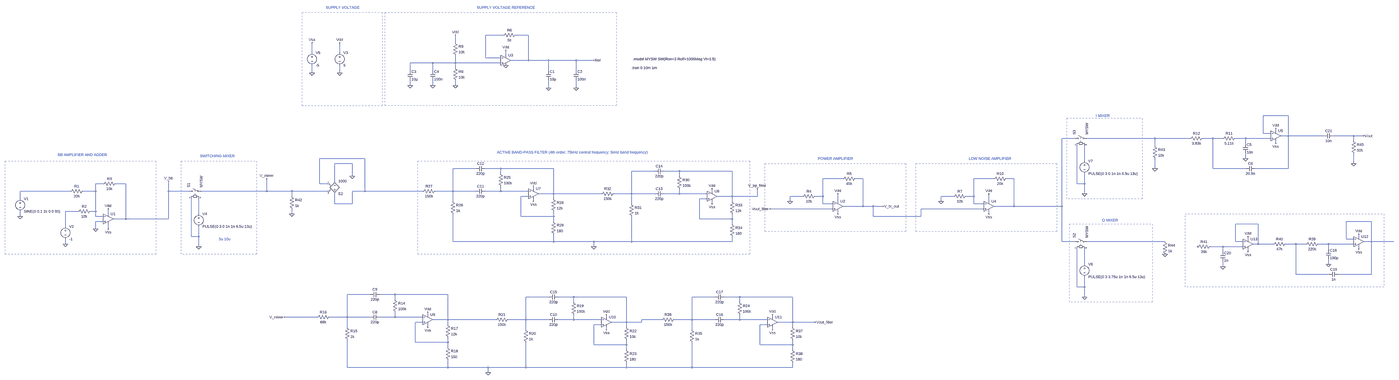
[diagram p0: schematic transceiver_aposAula.asc, whole sheet]
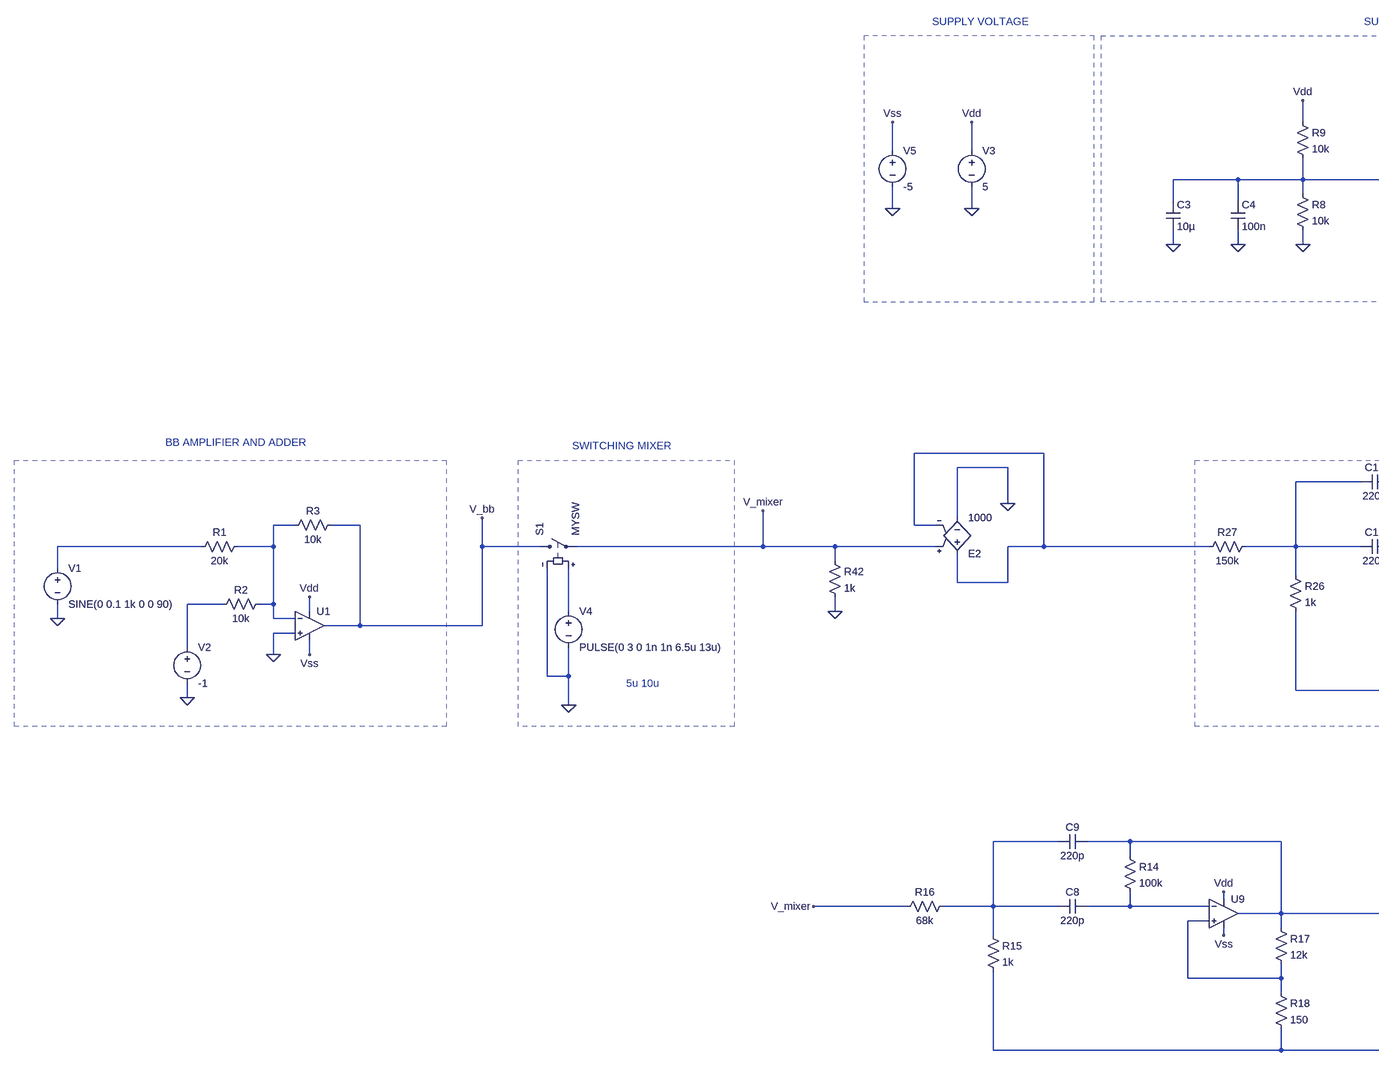
[diagram p1: schematic transceiver_aposAula.asc, part, row 1 of 1, column 1 of 3]
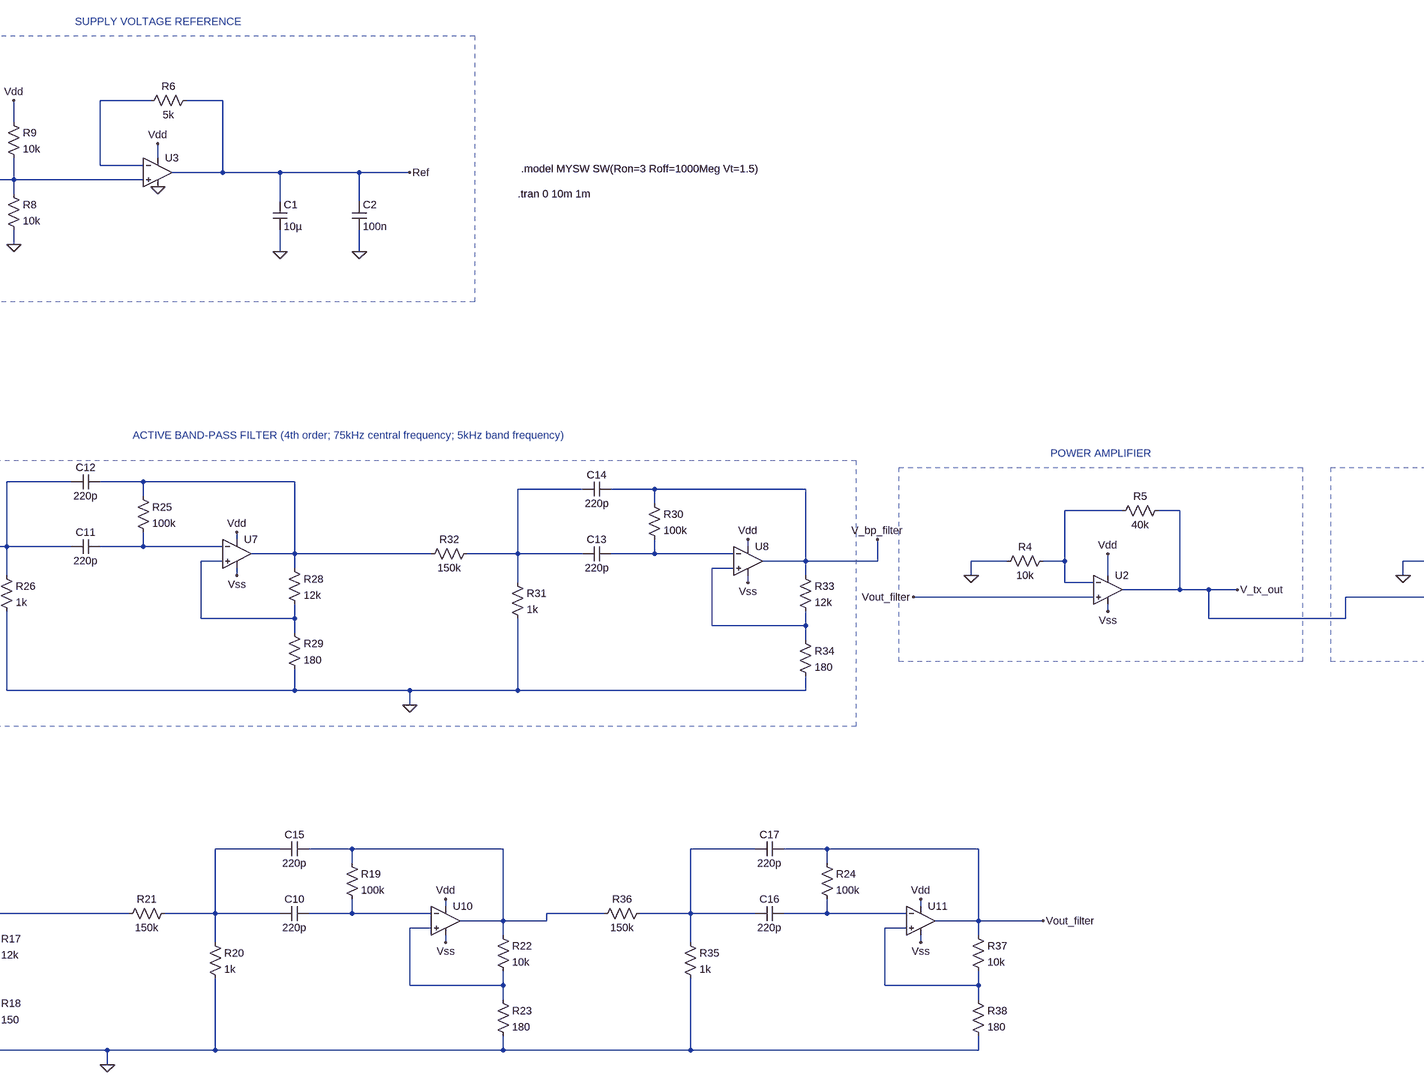
[diagram p2: schematic transceiver_aposAula.asc, part, row 1 of 1, column 2 of 3]
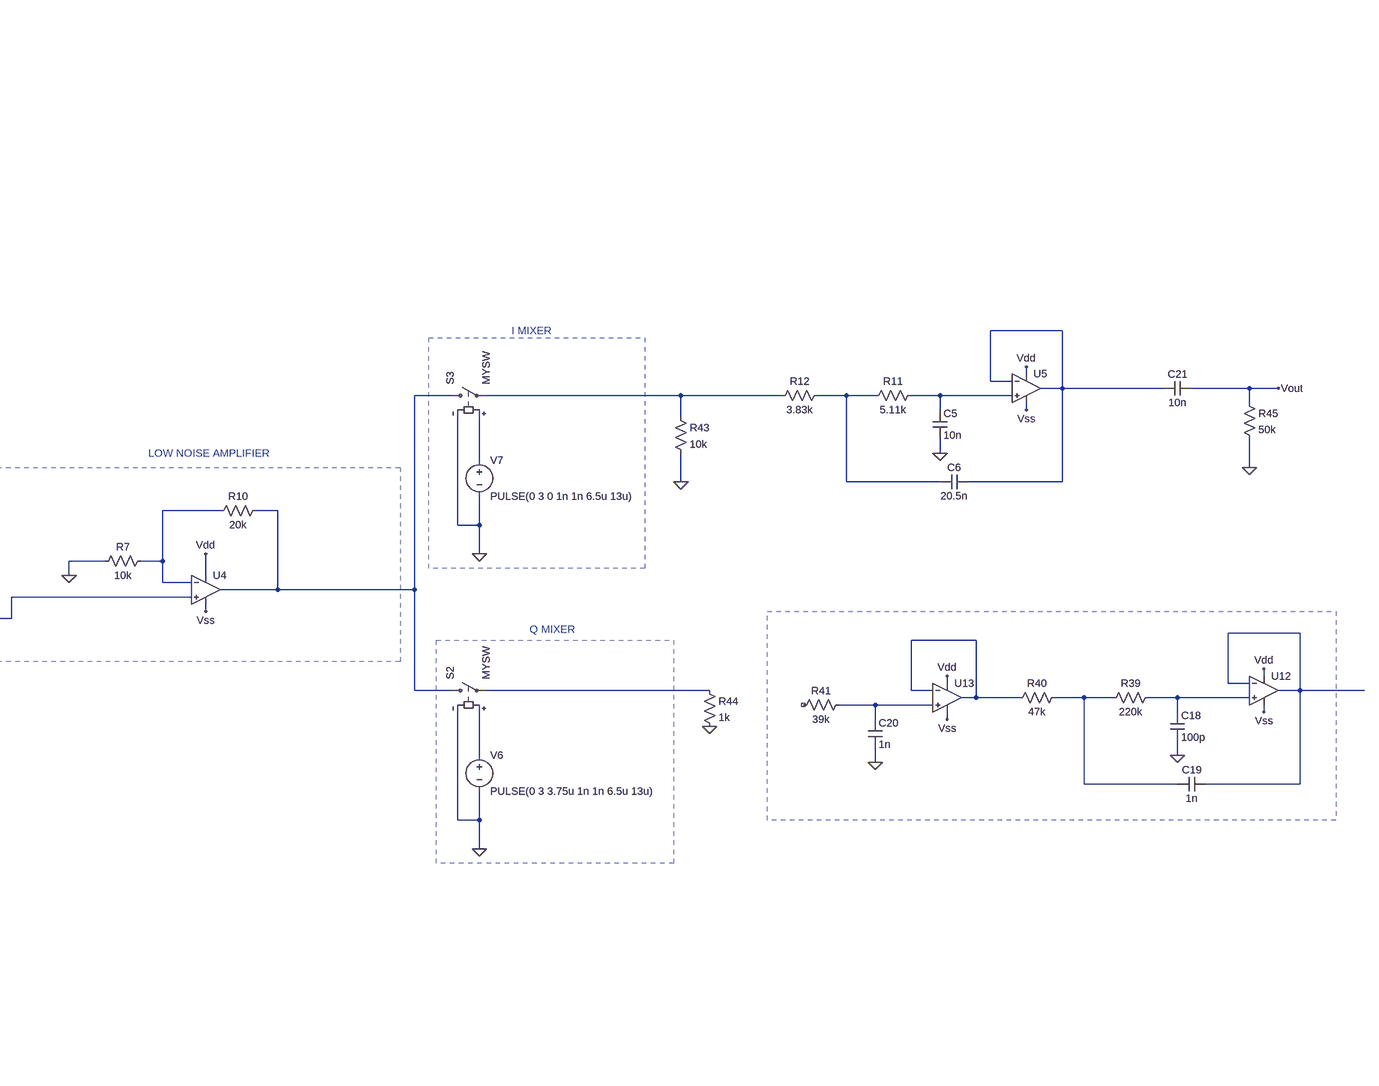
[diagram p3: schematic transceiver_aposAula.asc, part, row 1 of 1, column 3 of 3]
transceiver_aposAula.asc, the LTspice schematic file:
Version 4
SHEET 1 6180 1220
WIRE -192 -1264 -304 -1264
WIRE -32 -1264 -112 -1264
WIRE -496 -1216 -496 -1264
WIRE -1408 -1152 -1408 -1216
WIRE -1232 -1152 -1232 -1216
WIRE -176 -1136 -176 -1168
WIRE -304 -1120 -304 -1264
WIRE -208 -1120 -304 -1120
WIRE -32 -1104 -32 -1264
WIRE -32 -1104 -144 -1104
WIRE 96 -1104 -32 -1104
WIRE 272 -1104 96 -1104
WIRE 384 -1104 272 -1104
WIRE -640 -1088 -784 -1088
WIRE -496 -1088 -496 -1136
WIRE -496 -1088 -640 -1088
WIRE -208 -1088 -496 -1088
WIRE -496 -1056 -496 -1088
WIRE -784 -1040 -784 -1088
WIRE -640 -1040 -640 -1088
WIRE 96 -1040 96 -1104
WIRE 272 -1040 272 -1104
WIRE -1408 -1024 -1408 -1072
WIRE -1232 -1024 -1232 -1072
WIRE -784 -944 -784 -976
WIRE -640 -944 -640 -976
WIRE -496 -944 -496 -976
WIRE 96 -928 96 -976
WIRE 272 -928 272 -976
WIRE 4800 -752 4640 -752
WIRE 4720 -656 4720 -672
WIRE 4640 -640 4640 -752
WIRE 4688 -640 4640 -640
WIRE 4800 -624 4800 -752
WIRE 4800 -624 4752 -624
WIRE 5024 -624 4800 -624
WIRE 5216 -624 5088 -624
WIRE 5280 -624 5216 -624
WIRE 3440 -608 3360 -608
WIRE 3952 -608 3520 -608
WIRE 4176 -608 3952 -608
WIRE 4320 -608 4256 -608
WIRE 4384 -608 4320 -608
WIRE 4528 -608 4464 -608
WIRE 4688 -608 4528 -608
WIRE 5216 -592 5216 -624
WIRE 4528 -576 4528 -608
WIRE 4720 -576 4720 -592
WIRE 3952 -560 3952 -608
WIRE -1072 -480 -1360 -480
WIRE 4528 -480 4528 -512
WIRE 3504 -464 3504 -560
WIRE -1152 -448 -1264 -448
WIRE 5216 -448 5216 -512
WIRE -368 -416 -512 -416
WIRE -208 -416 -304 -416
WIRE 128 -416 -208 -416
WIRE 3952 -416 3952 -480
WIRE 4320 -416 4320 -608
WIRE 4528 -416 4320 -416
WIRE 4800 -416 4800 -624
WIRE 4800 -416 4592 -416
WIRE 768 -400 624 -400
WIRE 928 -400 832 -400
WIRE 1264 -400 928 -400
WIRE -208 -384 -208 -416
WIRE -1152 -368 -1152 -448
WIRE 928 -368 928 -400
WIRE 1968 -352 1840 -352
WIRE 2096 -352 2048 -352
WIRE 2928 -352 2800 -352
WIRE 3056 -352 3008 -352
WIRE -1264 -336 -1264 -448
WIRE -2736 -320 -2784 -320
WIRE -2592 -320 -2656 -320
WIRE -1360 -320 -1360 -480
WIRE -1312 -320 -1360 -320
WIRE 3456 -320 3456 -560
WIRE 3504 -320 3504 -384
WIRE 3504 -320 3456 -320
WIRE 0 -288 0 -304
WIRE -2944 -272 -3264 -272
WIRE -2784 -272 -2784 -320
WIRE -2784 -272 -2864 -272
WIRE -2320 -272 -2320 -336
WIRE -2192 -272 -2320 -272
WIRE -1696 -272 -1696 -352
WIRE -1696 -272 -2112 -272
WIRE -1536 -272 -1696 -272
WIRE -1312 -272 -1536 -272
WIRE -1072 -272 -1072 -480
WIRE -1072 -272 -1152 -272
WIRE -704 -272 -1072 -272
WIRE -512 -272 -512 -416
WIRE -512 -272 -624 -272
WIRE -368 -272 -512 -272
WIRE -208 -272 -208 -304
WIRE -208 -272 -304 -272
WIRE -32 -272 -208 -272
WIRE 1136 -272 1136 -288
WIRE 128 -256 128 -416
WIRE 128 -256 32 -256
WIRE 432 -256 128 -256
WIRE 624 -256 624 -400
WIRE 624 -256 512 -256
WIRE 768 -256 624 -256
WIRE 928 -256 928 -288
WIRE 928 -256 832 -256
WIRE 1104 -256 928 -256
WIRE 3504 -256 3504 -320
WIRE -1536 -240 -1536 -272
WIRE -32 -240 -80 -240
WIRE 1264 -240 1264 -400
WIRE 1264 -240 1168 -240
WIRE 1424 -240 1424 -288
WIRE 1424 -240 1264 -240
WIRE 1712 -240 1632 -240
WIRE 1840 -240 1840 -352
WIRE 1840 -240 1792 -240
WIRE 2672 -240 2592 -240
WIRE 2800 -240 2800 -352
WIRE 2800 -240 2752 -240
WIRE -3264 -224 -3264 -272
WIRE 128 -224 128 -256
WIRE 1104 -224 1056 -224
WIRE -512 -208 -512 -272
WIRE 0 -208 0 -224
WIRE 1264 -208 1264 -240
WIRE 1632 -208 1632 -240
WIRE 1936 -208 1936 -256
WIRE 2592 -208 2592 -240
WIRE 2896 -208 2896 -256
WIRE -1264 -192 -1264 -256
WIRE -1152 -192 -1152 -272
WIRE -1152 -192 -1264 -192
WIRE 624 -192 624 -256
WIRE 1136 -192 1136 -208
WIRE 1840 -192 1840 -240
WIRE 1904 -192 1840 -192
WIRE 2800 -192 2800 -240
WIRE 2864 -192 2800 -192
WIRE 2096 -176 2096 -352
WIRE 2096 -176 1968 -176
WIRE 2160 -176 2096 -176
WIRE 2224 -176 2160 -176
WIRE 3056 -176 3056 -352
WIRE 3056 -176 2928 -176
WIRE 3360 -176 3360 -608
WIRE 3360 -176 3056 -176
WIRE 1904 -160 1504 -160
WIRE 2864 -160 2464 -160
WIRE -2896 -144 -2976 -144
WIRE -2784 -144 -2784 -272
WIRE -2784 -144 -2816 -144
WIRE -2704 -128 -2704 -160
WIRE -2128 -128 -2128 -224
WIRE -1536 -128 -1536 -160
WIRE 1936 -128 1936 -144
WIRE 2896 -128 2896 -144
WIRE -3264 -112 -3264 -144
WIRE -2784 -112 -2784 -144
WIRE -2736 -112 -2784 -112
WIRE -80 -112 -80 -240
WIRE 128 -112 128 -144
WIRE 128 -112 -80 -112
WIRE 2160 -112 2160 -176
WIRE 2464 -112 2464 -160
WIRE 2464 -112 2160 -112
WIRE -2592 -96 -2592 -320
WIRE -2592 -96 -2672 -96
WIRE -2320 -96 -2320 -272
WIRE -2320 -96 -2592 -96
WIRE 1056 -96 1056 -224
WIRE 1264 -96 1264 -128
WIRE 1264 -96 1056 -96
WIRE -2736 -80 -2784 -80
WIRE 128 -80 128 -112
WIRE 5328 -80 5168 -80
WIRE 1264 -64 1264 -96
WIRE 4608 -64 4464 -64
WIRE -2976 -48 -2976 -144
WIRE -2784 -32 -2784 -80
WIRE -2704 -32 -2704 -64
WIRE -2176 16 -2176 -224
WIRE -2128 16 -2128 -48
WIRE -2128 16 -2176 16
WIRE 5248 16 5248 0
WIRE 4544 32 4544 16
WIRE 5168 32 5168 -80
WIRE 5216 32 5168 32
WIRE -512 48 -512 -128
WIRE 128 48 128 0
WIRE 128 48 -512 48
WIRE 384 48 128 48
WIRE 624 48 624 -112
WIRE 624 48 384 48
WIRE 1264 48 1264 16
WIRE 1264 48 624 48
WIRE 3360 48 3360 -176
WIRE 3440 48 3360 48
WIRE 4016 48 3520 48
WIRE 4464 48 4464 -64
WIRE 4512 48 4464 48
WIRE 5328 48 5328 -80
WIRE 5328 48 5280 48
WIRE 5472 48 5328 48
WIRE -2976 64 -2976 32
WIRE 4608 64 4608 -64
WIRE 4608 64 4576 64
WIRE 4704 64 4608 64
WIRE 4848 64 4784 64
WIRE 4912 64 4848 64
WIRE 5056 64 4992 64
WIRE 5216 64 5056 64
WIRE -2128 80 -2128 16
WIRE 384 80 384 48
WIRE 4384 80 4304 80
WIRE 4512 80 4384 80
WIRE 5056 96 5056 64
WIRE 5248 96 5248 80
WIRE 4384 112 4384 80
WIRE 4544 112 4544 96
WIRE 3504 192 3504 96
WIRE 5056 192 5056 160
WIRE 4384 208 4384 176
WIRE 4848 256 4848 64
WIRE 5056 256 4848 256
WIRE 5328 256 5328 48
WIRE 5328 256 5120 256
WIRE 3456 336 3456 96
WIRE 3504 336 3504 272
WIRE 3504 336 3456 336
WIRE -1040 384 -1184 384
WIRE -880 384 -976 384
WIRE -544 384 -880 384
WIRE 96 400 -48 400
WIRE 256 400 160 400
WIRE 592 400 256 400
WIRE 1152 400 1008 400
WIRE 1312 400 1216 400
WIRE 1648 400 1312 400
WIRE 3504 400 3504 336
WIRE -880 416 -880 384
WIRE 256 432 256 400
WIRE 1312 432 1312 400
WIRE -672 512 -672 496
WIRE -1376 528 -1584 528
WIRE -1184 528 -1184 384
WIRE -1184 528 -1296 528
WIRE -1040 528 -1184 528
WIRE -880 528 -880 496
WIRE -880 528 -976 528
WIRE -704 528 -880 528
WIRE 464 528 464 512
WIRE 1520 528 1520 512
WIRE -544 544 -544 384
WIRE -544 544 -640 544
WIRE -240 544 -544 544
WIRE -48 544 -48 400
WIRE -48 544 -160 544
WIRE 96 544 -48 544
WIRE 256 544 256 512
WIRE 256 544 160 544
WIRE 432 544 256 544
WIRE 816 544 688 544
WIRE 1008 544 1008 400
WIRE 1008 544 896 544
WIRE 1152 544 1008 544
WIRE 1312 544 1312 512
WIRE 1312 544 1216 544
WIRE 1488 544 1312 544
WIRE -704 560 -752 560
WIRE 592 560 592 400
WIRE 592 560 496 560
WIRE 688 560 688 544
WIRE 688 560 592 560
WIRE 1648 560 1648 400
WIRE 1648 560 1552 560
WIRE 1792 560 1648 560
WIRE -544 576 -544 544
WIRE 432 576 384 576
WIRE 1488 576 1440 576
WIRE -1184 592 -1184 528
WIRE -672 592 -672 576
WIRE 592 592 592 560
WIRE 1648 592 1648 560
WIRE -48 608 -48 544
WIRE 464 608 464 592
WIRE 1008 608 1008 544
WIRE 1520 608 1520 592
WIRE -752 688 -752 560
WIRE -544 688 -544 656
WIRE -544 688 -752 688
WIRE 384 704 384 576
WIRE 592 704 592 672
WIRE 592 704 384 704
WIRE 1440 704 1440 576
WIRE 1648 704 1648 672
WIRE 1648 704 1440 704
WIRE -544 720 -544 688
WIRE 592 736 592 704
WIRE 1648 736 1648 704
WIRE -1184 848 -1184 672
WIRE -544 848 -544 800
WIRE -544 848 -1184 848
WIRE -288 848 -544 848
WIRE -48 848 -48 688
WIRE -48 848 -288 848
WIRE 592 848 592 816
WIRE 592 848 -48 848
WIRE 1008 848 1008 688
WIRE 1008 848 592 848
WIRE 1648 848 1648 816
WIRE 1648 848 1008 848
WIRE -288 880 -288 848
FLAG -3264 -112 0
FLAG -2976 64 0
FLAG -2784 -32 0
FLAG -2704 -160 Vdd
FLAG -1232 -1216 Vdd
FLAG -1232 -1024 0
FLAG 1632 -208 0
FLAG 1936 -256 Vdd
FLAG -2128 80 0
FLAG 2224 -176 V_tx_out
FLAG 96 -928 0
FLAG 272 -928 0
FLAG -176 -1072 0
FLAG -784 -944 0
FLAG -640 -944 0
FLAG -496 -944 0
FLAG -496 -1264 Vdd
FLAG 384 -1104 Ref
FLAG -176 -1168 Vdd
FLAG 0 -304 Vdd
FLAG 1136 -288 Vdd
FLAG -2320 -336 V_bb
FLAG -1696 -352 V_mixer
FLAG -1408 -1024 0
FLAG -1408 -1216 Vss
FLAG -2704 -32 Vss
FLAG 0 -208 Vss
FLAG 1136 -192 Vss
FLAG 1936 -128 Vss
FLAG 384 80 0
FLAG 1424 -288 V_bp_filter
FLAG 2592 -208 0
FLAG 2896 -256 Vdd
FLAG 2896 -128 Vss
FLAG 3504 400 0
FLAG 3504 -256 0
FLAG 4720 -672 Vdd
FLAG 4720 -576 Vss
FLAG 4528 -480 0
FLAG -672 496 Vdd
FLAG 464 512 Vdd
FLAG -672 592 Vss
FLAG 464 608 Vss
FLAG -288 880 0
FLAG 1520 512 Vdd
FLAG 1520 608 Vss
FLAG -1584 528 V_mixer
FLAG 1792 560 Vout_filter
FLAG 5248 0 Vdd
FLAG 5248 96 Vss
FLAG 5056 192 0
FLAG 4544 16 Vdd
FLAG 4544 112 Vss
FLAG 4384 208 0
FLAG 4016 128 0
FLAG 1504 -160 Vout_filter
FLAG -1152 -368 0
FLAG -1536 -128 0
FLAG 3952 -416 0
FLAG 5216 -448 0
FLAG 5280 -624 Vout
SYMBOL voltage -3264 -240 R0
WINDOW 123 0 0 Left 0
WINDOW 39 0 0 Left 0
SYMATTR InstName V1
SYMATTR Value SINE(0 0.1 1k 0 0 90)
SYMBOL res -2848 -288 R90
WINDOW 0 0 56 VBottom 2
WINDOW 3 32 56 VTop 2
SYMATTR InstName R1
SYMATTR Value 20k
SYMBOL res -2800 -160 R90
WINDOW 0 0 56 VBottom 2
WINDOW 3 32 56 VTop 2
SYMATTR InstName R2
SYMATTR Value 10k
SYMBOL res -2640 -336 R90
WINDOW 0 0 56 VBottom 2
WINDOW 3 32 56 VTop 2
SYMATTR InstName R3
SYMATTR Value 10k
SYMBOL OpAmps\\UniversalOpAmp2 -2704 -96 R0
SYMATTR InstName U1
SYMBOL OpAmps\\UniversalOpAmp2 1936 -176 R0
SYMATTR InstName U2
SYMBOL voltage -1232 -1168 R0
WINDOW 123 0 0 Left 0
WINDOW 39 0 0 Left 0
SYMATTR InstName V3
SYMATTR Value 5
SYMBOL res 1808 -256 R90
WINDOW 0 0 56 VBottom 2
WINDOW 3 32 56 VTop 2
SYMATTR InstName R4
SYMATTR Value 10k
SYMBOL res 2064 -368 R90
WINDOW 0 0 56 VBottom 2
WINDOW 3 32 56 VTop 2
SYMATTR InstName R5
SYMATTR Value 40k
SYMBOL sw -2208 -272 R270
SYMATTR InstName S1
SYMATTR Value MYSW
SYMBOL voltage -2128 -144 R0
WINDOW 123 0 0 Left 0
WINDOW 39 0 0 Left 0
SYMATTR InstName V4
SYMATTR Value PULSE(0 3 0 1n 1n 6.5u 13u)
SYMBOL OpAmps\\UniversalOpAmp2 -176 -1104 R0
SYMATTR InstName U3
SYMBOL res -96 -1280 R90
WINDOW 0 0 56 VBottom 2
WINDOW 3 32 56 VTop 2
SYMATTR InstName R6
SYMATTR Value 5k
SYMBOL cap 80 -1040 R0
SYMATTR InstName C1
SYMATTR Value 10µ
SYMBOL cap 256 -1040 R0
SYMATTR InstName C2
SYMATTR Value 100n
SYMBOL res -512 -1072 R0
SYMATTR InstName R8
SYMATTR Value 10k
SYMBOL res -512 -1232 R0
SYMATTR InstName R9
SYMATTR Value 10k
SYMBOL cap -800 -1040 R0
SYMATTR InstName C3
SYMATTR Value 10µ
SYMBOL cap -656 -1040 R0
SYMATTR InstName C4
SYMATTR Value 100n
SYMBOL OpAmps\\UniversalOpAmp2 0 -256 R0
SYMATTR InstName U7
SYMBOL cap -304 -288 R90
WINDOW 0 0 32 VBottom 2
WINDOW 3 32 32 VTop 2
SYMATTR InstName C11
SYMATTR Value 220p
SYMBOL cap -304 -432 R90
WINDOW 0 0 32 VBottom 2
WINDOW 3 32 32 VTop 2
SYMATTR InstName C12
SYMATTR Value 220p
SYMBOL res -224 -400 R0
SYMATTR InstName R25
SYMATTR Value 100k
SYMBOL res -528 -224 R0
SYMATTR InstName R26
SYMATTR Value 1k
SYMBOL res -608 -288 R90
WINDOW 0 0 56 VBottom 2
WINDOW 3 32 56 VTop 2
SYMATTR InstName R27
SYMATTR Value 150k
SYMBOL res 112 -240 R0
SYMATTR InstName R28
SYMATTR Value 12k
SYMBOL res 112 -96 R0
SYMATTR InstName R29
SYMATTR Value 180
SYMBOL OpAmps\\UniversalOpAmp2 1136 -240 R0
SYMATTR InstName U8
SYMBOL cap 832 -272 R90
WINDOW 0 0 32 VBottom 2
WINDOW 3 32 32 VTop 2
SYMATTR InstName C13
SYMATTR Value 220p
SYMBOL cap 832 -416 R90
WINDOW 0 0 32 VBottom 2
WINDOW 3 32 32 VTop 2
SYMATTR InstName C14
SYMATTR Value 220p
SYMBOL res 912 -384 R0
SYMATTR InstName R30
SYMATTR Value 100k
SYMBOL res 608 -208 R0
SYMATTR InstName R31
SYMATTR Value 1k
SYMBOL res 528 -272 R90
WINDOW 0 0 56 VBottom 2
WINDOW 3 32 56 VTop 2
SYMATTR InstName R32
SYMATTR Value 150k
SYMBOL res 1248 -224 R0
SYMATTR InstName R33
SYMATTR Value 12k
SYMBOL res 1248 -80 R0
SYMATTR InstName R34
SYMATTR Value 180
SYMBOL voltage -1408 -1168 R0
WINDOW 123 0 0 Left 0
WINDOW 39 0 0 Left 0
SYMATTR InstName V5
SYMATTR Value -5
SYMBOL voltage -2976 -64 R0
WINDOW 123 0 0 Left 0
WINDOW 39 0 0 Left 0
SYMATTR InstName V2
SYMATTR Value -1
SYMBOL OpAmps\\UniversalOpAmp2 2896 -176 R0
SYMATTR InstName U4
SYMBOL res 2768 -256 R90
WINDOW 0 0 56 VBottom 2
WINDOW 3 32 56 VTop 2
SYMATTR InstName R7
SYMATTR Value 10k
SYMBOL res 3024 -368 R90
WINDOW 0 0 56 VBottom 2
WINDOW 3 32 56 VTop 2
SYMATTR InstName R10
SYMATTR Value 20k
SYMBOL sw 3424 48 R270
SYMATTR InstName S2
SYMATTR Value MYSW
SYMBOL voltage 3504 176 R0
WINDOW 123 0 0 Left 0
WINDOW 39 0 0 Left 0
SYMATTR InstName V6
SYMATTR Value PULSE(0 3 3.75u 1n 1n 6.5u 13u)
SYMBOL sw 3424 -608 R270
SYMATTR InstName S3
SYMATTR Value MYSW
SYMBOL voltage 3504 -480 R0
WINDOW 123 0 0 Left 0
WINDOW 39 0 0 Left 0
SYMATTR InstName V7
SYMATTR Value PULSE(0 3 0 1n 1n 6.5u 13u)
SYMBOL OpAmps\\UniversalOpAmp2 4720 -624 R0
SYMATTR InstName U5
SYMBOL cap 4512 -576 R0
SYMATTR InstName C5
SYMATTR Value 10n
SYMBOL cap 4592 -432 R90
WINDOW 0 0 32 VBottom 2
WINDOW 3 32 32 VTop 2
SYMATTR InstName C6
SYMATTR Value 20.5n
SYMBOL res 4480 -624 R90
WINDOW 0 0 56 VBottom 2
WINDOW 3 32 56 VTop 2
SYMATTR InstName R11
SYMATTR Value 5.11k
SYMBOL res 4272 -624 R90
WINDOW 0 0 56 VBottom 2
WINDOW 3 32 56 VTop 2
SYMATTR InstName R12
SYMATTR Value 3.83k
SYMBOL OpAmps\\UniversalOpAmp2 -672 544 R0
SYMATTR InstName U9
SYMBOL cap -976 512 R90
WINDOW 0 0 32 VBottom 2
WINDOW 3 32 32 VTop 2
SYMATTR InstName C8
SYMATTR Value 220p
SYMBOL cap -976 368 R90
WINDOW 0 0 32 VBottom 2
WINDOW 3 32 32 VTop 2
SYMATTR InstName C9
SYMATTR Value 220p
SYMBOL res -896 400 R0
SYMATTR InstName R14
SYMATTR Value 100k
SYMBOL res -1200 576 R0
SYMATTR InstName R15
SYMATTR Value 1k
SYMBOL res -1280 512 R90
WINDOW 0 0 56 VBottom 2
WINDOW 3 32 56 VTop 2
SYMATTR InstName R16
SYMATTR Value 68k
SYMBOL res -560 560 R0
SYMATTR InstName R17
SYMATTR Value 12k
SYMBOL res -560 704 R0
SYMATTR InstName R18
SYMATTR Value 150
SYMBOL OpAmps\\UniversalOpAmp2 464 560 R0
SYMATTR InstName U10
SYMBOL cap 160 528 R90
WINDOW 0 0 32 VBottom 2
WINDOW 3 32 32 VTop 2
SYMATTR InstName C10
SYMATTR Value 220p
SYMBOL cap 160 384 R90
WINDOW 0 0 32 VBottom 2
WINDOW 3 32 32 VTop 2
SYMATTR InstName C15
SYMATTR Value 220p
SYMBOL res 240 416 R0
SYMATTR InstName R19
SYMATTR Value 100k
SYMBOL res -64 592 R0
SYMATTR InstName R20
SYMATTR Value 1k
SYMBOL res -144 528 R90
WINDOW 0 0 56 VBottom 2
WINDOW 3 32 56 VTop 2
SYMATTR InstName R21
SYMATTR Value 150k
SYMBOL res 576 576 R0
SYMATTR InstName R22
SYMATTR Value 10k
SYMBOL res 576 720 R0
SYMATTR InstName R23
SYMATTR Value 180
SYMBOL OpAmps\\UniversalOpAmp2 1520 560 R0
SYMATTR InstName U11
SYMBOL cap 1216 528 R90
WINDOW 0 0 32 VBottom 2
WINDOW 3 32 32 VTop 2
SYMATTR InstName C16
SYMATTR Value 220p
SYMBOL cap 1216 384 R90
WINDOW 0 0 32 VBottom 2
WINDOW 3 32 32 VTop 2
SYMATTR InstName C17
SYMATTR Value 220p
SYMBOL res 1296 416 R0
SYMATTR InstName R24
SYMATTR Value 100k
SYMBOL res 992 592 R0
SYMATTR InstName R35
SYMATTR Value 1k
SYMBOL res 912 528 R90
WINDOW 0 0 56 VBottom 2
WINDOW 3 32 56 VTop 2
SYMATTR InstName R36
SYMATTR Value 150k
SYMBOL res 1632 576 R0
SYMATTR InstName R37
SYMATTR Value 10k
SYMBOL res 1632 720 R0
SYMATTR InstName R38
SYMATTR Value 180
SYMBOL OpAmps\\UniversalOpAmp2 5248 48 R0
SYMATTR InstName U12
SYMBOL cap 5040 96 R0
SYMATTR InstName C18
SYMATTR Value 100p
SYMBOL cap 5120 240 R90
WINDOW 0 0 32 VBottom 2
WINDOW 3 32 32 VTop 2
SYMATTR InstName C19
SYMATTR Value 1n
SYMBOL res 5008 48 R90
WINDOW 0 0 56 VBottom 2
WINDOW 3 32 56 VTop 2
SYMATTR InstName R39
SYMATTR Value 220k
SYMBOL res 4800 48 R90
WINDOW 0 0 56 VBottom 2
WINDOW 3 32 56 VTop 2
SYMATTR InstName R40
SYMATTR Value 47k
SYMBOL OpAmps\\UniversalOpAmp2 4544 64 R0
SYMATTR InstName U13
SYMBOL cap 4368 112 R0
SYMATTR InstName C20
SYMATTR Value 1n
SYMBOL res 4320 64 R90
WINDOW 0 0 56 VBottom 2
WINDOW 3 32 56 VTop 2
SYMATTR InstName R41
SYMATTR Value 39k
SYMBOL res 4000 32 R0
SYMATTR InstName R44
SYMATTR Value 1k
SYMBOL e -1264 -240 M180
SYMATTR InstName E2
SYMATTR Value 1000
SYMBOL res -1552 -256 R0
SYMATTR InstName R42
SYMATTR Value 1k
SYMBOL res 3936 -576 R0
SYMATTR InstName R43
SYMATTR Value 10k
SYMBOL cap 5088 -640 R90
WINDOW 0 0 32 VBottom 2
WINDOW 3 32 32 VTop 2
SYMATTR InstName C21
SYMATTR Value 10n
SYMBOL res 5200 -608 R0
SYMATTR InstName R45
SYMATTR Value 50k
TEXT 624 -1056 Left 2 !.tran 0 10m 1m
TEXT 632 -1112 Left 2 !.model MYSW SW(Ron=3 Roff=1000Meg Vt=1.5)
TEXT -360 -1440 Left 2 ;SUPPLY VOLTAGE REFERENCE
TEXT -232 -520 Left 2 ;ACTIVE BAND-PASS FILTER (4th order; 75kHz central frequency; 5kHz band frequency)
TEXT -1320 -1440 Left 2 ;SUPPLY VOLTAGE
TEXT -2120 -496 Left 2 ;SWITCHING MIXER
TEXT -3024 -504 Left 2 ;BB AMPLIFIER AND ADDER
TEXT 1808 -480 Left 2 ;POWER AMPLIFIER
TEXT -2000 32 Left 2 ;5u 10u
TEXT 2768 -480 Left 2 ;LOW NOISE AMPLIFIER
TEXT 3576 -752 Left 2 ;I MIXER
TEXT 3616 -88 Left 2 ;Q MIXER
RECTANGLE Normal 528 -816 -944 -1408 2
RECTANGLE Normal -1472 -816 -960 -1408 2
RECTANGLE Normal -2400 128 -3360 -464 2
RECTANGLE Normal -1760 128 -2240 -464 2
RECTANGLE Normal 1376 128 -736 -464 2
RECTANGLE Normal 2368 -16 1472 -448 2
RECTANGLE Normal 3328 -16 2432 -448 2
RECTANGLE Normal 5408 336 4144 -128 2
RECTANGLE Normal 3872 -224 3392 -736 2
RECTANGLE Normal 3936 432 3408 -64 2

The netlist it stands for:
* transceiver_aposAula.asc
V1 N016 0 SINE(0 0.1 1k 0 0 90)
R1 N015 N016 20k
R2 N015 N021 10k
R3 V_bb N015 10k
XU1 0 N015 Vdd Vss V_bb level2 Avol=1Meg GBW=10Meg Slew=10Meg Ilimit=25m Rail=0 Vos=0 En=0 Enk=0 In=0 Ink=0 Rin=500Meg  ; pins In+ In- V+ V- OUT
XU2 Vout_filter N013 Vdd Vss V_tx_out level2 Avol=1Meg GBW=10Meg Slew=10Meg Ilimit=25m Rail=0 Vos=0 En=0 Enk=0 In=0 Ink=0 Rin=500Meg  ; pins In+ In- V+ V- OUT
V3 Vdd 0 5
R4 N013 0 10k
R5 V_tx_out N013 40k
S1 V_bb V_mixer N022 0 MYSW
V4 N022 0 PULSE(0 3 0 1n 1n 6.5u 13u)
XU3 N002 N001 Vdd 0 Ref level2 Avol=1Meg GBW=10Meg Slew=10Meg Ilimit=25m Rail=0 Vos=0 En=0 Enk=0 In=0 Ink=0 Rin=500Meg  ; pins In+ In- V+ V- OUT
R6 Ref N001 5k
C1 Ref 0 10µ
C2 Ref 0 100n
R8 N002 0 10k
R9 Vdd N002 10k
C3 N002 0 10µ
C4 N002 0 100n
XU7 N019 N017 Vdd Vss N011 level2 Avol=1Meg GBW=10Meg Slew=10Meg Ilimit=25m Rail=0 Vos=0 En=0 Enk=0 In=0 Ink=0 Rin=500Meg  ; pins In+ In- V+ V- OUT
C11 N017 N010 220p
C12 N011 N010 220p
R25 N011 N017 100k
R26 N010 0 1k
R27 N010 N008 150k
R28 N011 N019 12k
R29 N019 0 180
XU8 N020 N018 Vdd Vss V_bp_filter level2 Avol=1Meg GBW=10Meg Slew=10Meg Ilimit=25m Rail=0 Vos=0 En=0 Enk=0 In=0 Ink=0 Rin=500Meg  ; pins In+ In- V+ V- OUT
C13 N018 N012 220p
C14 V_bp_filter N012 220p
R30 V_bp_filter N018 100k
R31 N012 0 1k
R32 N012 N011 150k
R33 V_bp_filter N020 12k
R34 N020 0 180
V5 Vss 0 -5
V2 N021 0 -1
XU4 V_tx_out N014 Vdd Vss N004 level2 Avol=1Meg GBW=10Meg Slew=10Meg Ilimit=25m Rail=0 Vos=0 En=0 Enk=0 In=0 Ink=0 Rin=500Meg  ; pins In+ In- V+ V- OUT
R7 N014 0 10k
R10 N004 N014 20k
S2 N004 N025 N029 0 MYSW
V6 N029 0 PULSE(0 3 3.75u 1n 1n 6.5u 13u)
S3 N004 N005 N009 0 MYSW
V7 N009 0 PULSE(0 3 0 1n 1n 6.5u 13u)
XU5 N007 N003 Vdd Vss N003 level2 Avol=1Meg GBW=10Meg Slew=10Meg Ilimit=25m Rail=0 Vos=0 En=0 Enk=0 In=0 Ink=0 Rin=500Meg  ; pins In+ In- V+ V- OUT
C5 N007 0 10n
C6 N003 N006 20.5n
R11 N007 N006 5.11k
R12 N006 N005 3.83k
XU9 N038 N035 Vdd Vss N031 level2 Avol=1Meg GBW=10Meg Slew=10Meg Ilimit=25m Rail=0 Vos=0 En=0 Enk=0 In=0 Ink=0 Rin=500Meg  ; pins In+ In- V+ V- OUT
C8 N035 N030 220p
C9 N031 N030 220p
R14 N031 N035 100k
R15 N030 0 1k
R16 N030 V_mixer 68k
R17 N031 N038 12k
R18 N038 0 150
XU10 N039 N036 Vdd Vss N033 level2 Avol=1Meg GBW=10Meg Slew=10Meg Ilimit=25m Rail=0 Vos=0 En=0 Enk=0 In=0 Ink=0 Rin=500Meg  ; pins In+ In- V+ V- OUT
C10 N036 N032 220p
C15 N033 N032 220p
R19 N033 N036 100k
R20 N032 0 1k
R21 N032 N031 150k
R22 N033 N039 10k
R23 N039 0 180
XU11 N040 N037 Vdd Vss Vout_filter level2 Avol=1Meg GBW=10Meg Slew=10Meg Ilimit=25m Rail=0 Vos=0 En=0 Enk=0 In=0 Ink=0 Rin=500Meg  ; pins In+ In- V+ V- OUT
C16 N037 N034 220p
C17 Vout_filter N034 220p
R24 Vout_filter N037 100k
R35 N034 0 1k
R36 N034 N033 150k
R37 Vout_filter N040 10k
R38 N040 0 180
XU12 N027 N023 Vdd Vss N023 level2 Avol=1Meg GBW=10Meg Slew=10Meg Ilimit=25m Rail=0 Vos=0 En=0 Enk=0 In=0 Ink=0 Rin=500Meg  ; pins In+ In- V+ V- OUT
C18 N027 0 100p
C19 N023 N026 1n
R39 N027 N026 220k
R40 N026 N024 47k
XU13 N028 N024 Vdd Vss N024 level2 Avol=1Meg GBW=10Meg Slew=10Meg Ilimit=25m Rail=0 Vos=0 En=0 Enk=0 In=0 Ink=0 Rin=500Meg  ; pins In+ In- V+ V- OUT
C20 N028 0 1n
R41 N028 NC_01 39k
R44 N025 0 1k
E2 N008 0 V_mixer N008 1000
R42 V_mixer 0 1k
R43 N005 0 10k
C21 Vout N003 10n
R45 Vout 0 50k
.tran 0 10m 1m
.model MYSW SW(Ron=3 Roff=1000Meg Vt=1.5)
* SUPPLY VOLTAGE REFERENCE
* ACTIVE BAND-PASS FILTER (4th order; 75kHz central frequency; 5kHz band frequency)
* SUPPLY VOLTAGE
* SWITCHING MIXER
* BB AMPLIFIER AND ADDER
* POWER AMPLIFIER
* 5u 10u
* LOW NOISE AMPLIFIER
* I MIXER
* Q MIXER
.lib UniversalOpAmp2.lib
.backanno
.end